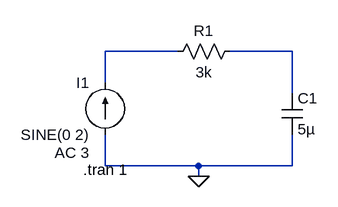
[diagram p0: schematic Draft1.asc]
Draft1.asc, the LTspice schematic file:
Version 4
SHEET 1 880 680
WIRE 176 80 64 80
WIRE 352 80 256 80
WIRE 64 128 64 80
WIRE 352 144 352 80
WIRE 64 256 64 208
WIRE 208 256 64 256
WIRE 352 256 352 208
WIRE 352 256 208 256
WIRE 208 272 208 256
FLAG 208 272 0
SYMBOL res 272 64 R90
WINDOW 0 0 56 VBottom 2
WINDOW 3 32 56 VTop 2
SYMATTR InstName R1
SYMATTR Value 3k
SYMBOL cap 336 144 R0
SYMATTR InstName C1
SYMATTR Value 5µ
SYMBOL current 64 208 R180
WINDOW 0 24 80 Left 2
WINDOW 3 24 0 Left 2
WINDOW 123 24 -28 Left 2
WINDOW 39 0 0 Left 0
SYMATTR InstName I1
SYMATTR Value SINE(0 2)
SYMATTR Value2 AC 3
TEXT 30 262 Left 2 !.tran 1

The netlist it stands for:
* Draft1.asc
R1 N002 N001 3k
C1 N002 0 5µ
I1 0 N001 SINE(0 2) AC 3
.tran 1
.backanno
.end